# Altium schematic sheet MOSFETs.SchDoc
size A
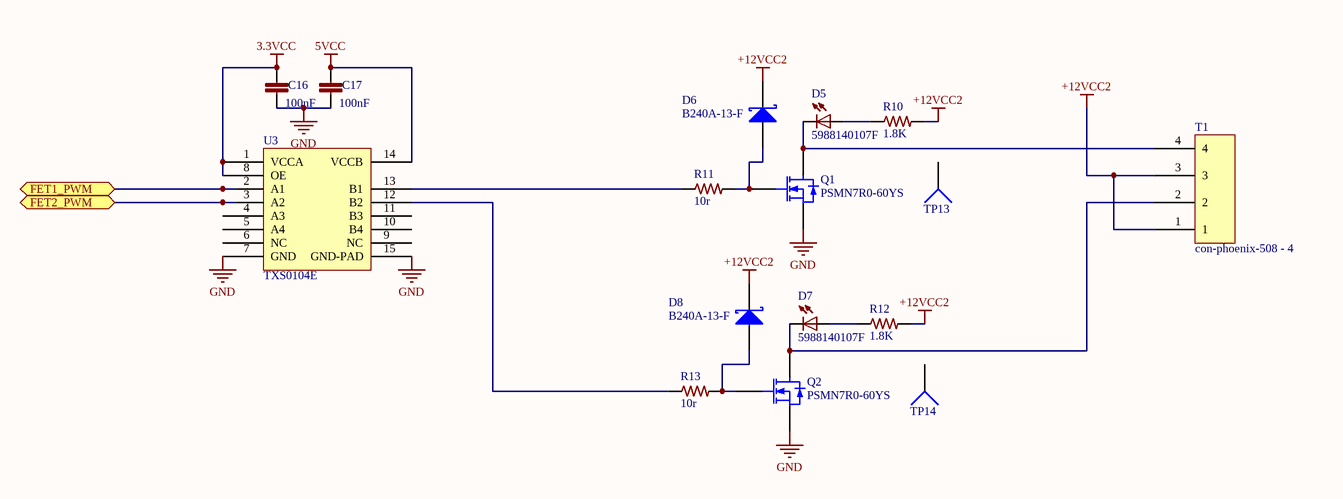
[diagram p0: MOSFETs.SchDoc]

## Parts
C16  100nF  [C0402]
C17  100nF  [C0402]
D5  5988140107F  [LED2012120]
D6  B240A-13-F  [SK310A-TP]
D7  5988140107F  [LED2012120]
D8  B240A-13-F  [SK310A-TP]
Q1  PSMN7R0-60YS  [PSMN7R0-60YS]
Q2  PSMN7R0-60YS  [PSMN7R0-60YS]
R10  1.8K  [R0603]
R11  10r  [R0603]
R12  1.8K  [R0603]
R13  10r  [R0603]
T1  con-phoenix-508 - 4  [MSTBV4]
TP13  TP4  [TP-2]  (value not drawn)
TP14  TP4  [TP-2]  (value not drawn)
U3  TXS0104E  [RGY  (S-PVQFN-N14)]

## Ports
FET1_PWM, FET2_PWM

## Nets
3.3VCC: C16.1 U3.1(VCCA) U3.8(OE)
5VCC: C17.1 U3.14(VCCB)
+12VCC2: D6.2(K) D8.2(K) R10.2 R12.2 T1.1 T1.3
GND: C16.2 C17.2 Q1.1(S) Q1.2(S) Q1.3(S) Q2.1(S) Q2.2(S) Q2.3(S) U3.7(GND) U3.15(GND-PAD)
FET1_PWM: U3.2(A1) ; port FET1_PWM
FET2_PWM: U3.3(A2) ; port FET2_PWM
NetD5_A: D5.A R10.1
NetD5_C: D5.C Q1.5(D) T1.4
NetD6_1: D6.1(A) Q1.4(G) R11.2
NetD7_A: D7.A R12.1
NetD7_C: D7.C Q2.5(D) T1.2
NetD8_1: D8.1(A) Q2.4(G) R13.2
NetR11_1: R11.1 U3.13(B1)
NetR13_1: R13.1 U3.12(B2)

Not connected (* = marked no-connect by the designer): TP13 1; TP14 1; U3 4(A3) 5(A4) 6(NC) 9(NC) 10(B4) 11(B3)

## Library data of the parts
C16 C17 = GRM155R71C104KA88D: CAP CER 0402 100nF 16V 10% X7R; LastRevisionNote: ImportComponents; Published: 23-Apr-2014; Publisher: UltiMachine; LastRevisionDate: 23-Apr-2014; ManufacturerPartNumber: GRM155R71C104KA88D; VALUE: 100nF
D5 D7 = 5988140107F: LED 0805 Yellow; LastRevisionNote: ImportComponents; Published: 23-Apr-2014; Publisher: UltiMachine; LastRevisionDate: 23-Apr-2014; VALUE: 5988140107F
D6 D8 = D Schottky: Schottky Diode; Published: 8-Jun-2000; LatestRevisionDate: 17-Jul-2002; LatestRevisionNote: Re-released for DXP Platform.; PackageReference: SMB; Publisher: Altium Limited; PackageDescription: DO-214-AA/SMB; 2 C-Bend Leads; Body 5.3 x 3.6 mm, inc. leads (LxW); Code_JEDEC: DO-214-AA
Q1 Q2 = PSMN7R0-60YS: N-Channel MOSFET; Published: 8-Jun-2000; LatestRevisionDate: 17-Jul-2002; LatestRevisionNote: Re-released for DXP Platform.; PackageVersion: 1995/1996; PackageReference: E3; Publisher: Altium Limited; PackageDescription: TO, Flat Index; 3 In-Line, Axial Leads; Body Dia. 4.6mm; Lead Dia. 0.5 mm (max)
R10 R12 = RC0603JR-071K8L: RES 0603 1.8K 100mW 5%; LastRevisionNote: ImportComponents; Published: 23-Apr-2014; Publisher: UltiMachine; LastRevisionDate: 23-Apr-2014; ManufacturerPartNumber: RC0603JR-071K8L; VALUE: 1.8K
R11 R13 = CRCW060310R0FKEA: RES 0603 10r 100mW 1%; LastRevisionNote: ImportComponents; Published: 23-Apr-2014; Publisher: UltiMachine; LastRevisionDate: 23-Apr-2014; ManufacturerPartNumber: CRCW060310R0FKEA; VALUE: 10r
T1 = con-phoenix-508_4
TP13 TP14 = Socket: LatestRevisionDate: 17-Jul-2002; LatestRevisionNote: Re-released for DXP Platform.; Publisher: Altium Limited
U3 = TXS0104E: TXS0104E - Bidriectional Opendrain/pushpull level shift; MFR: Texas Instruments; MFR Part #: TXS0104ERGYR; Active: Yes; Digikey Part #: 296-20698-2-ND; Height: 1mm; mounting Type: SMD; Datasheet: http://www.ti.com/lit/ds/symlink/txs0104e.pdf; Lead Free ?: RhoS